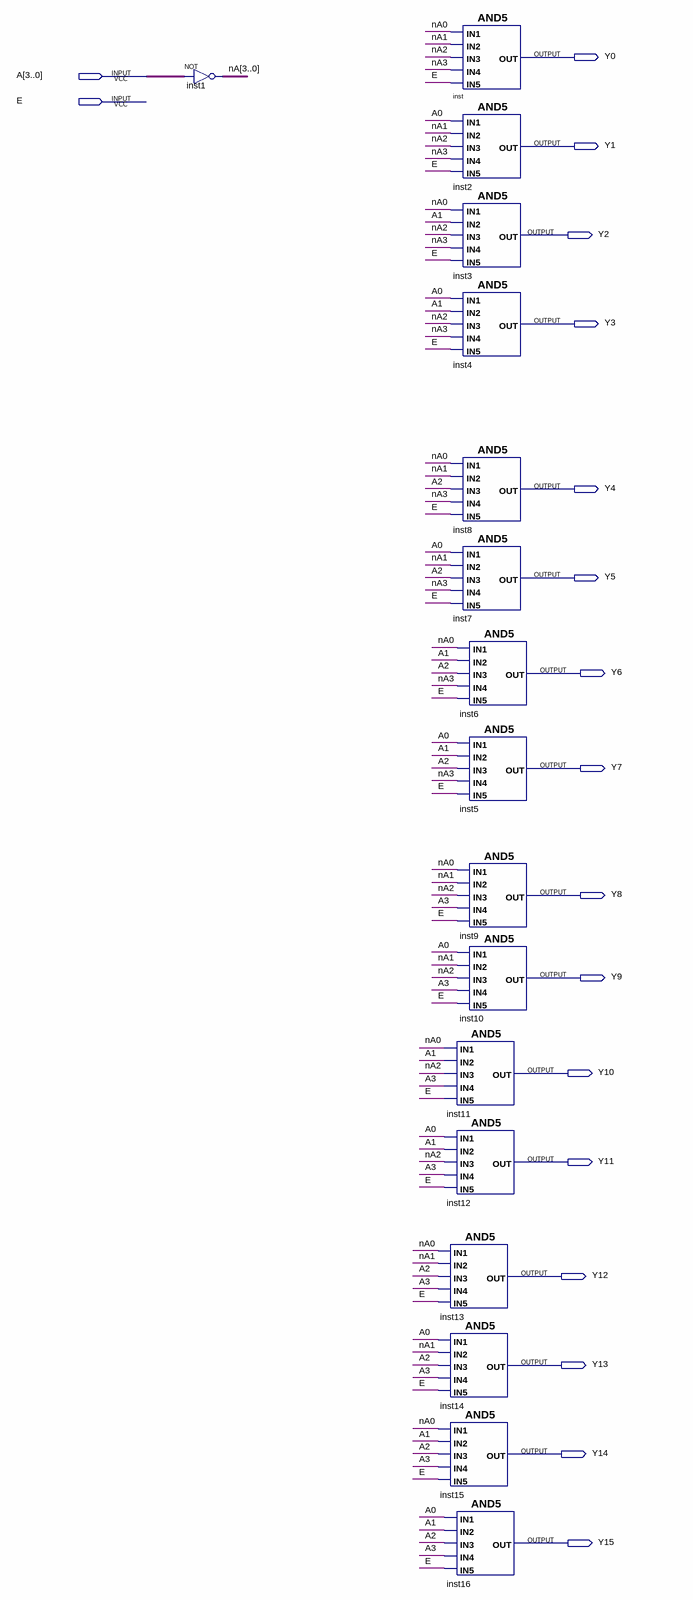
[diagram p0: schematic sheet]
// Quartus schematic DC16TO4.bdf as structural Verilog: 17 symbols, 18 pins
module DC16TO4 (
  input  [3:0] A,
  input  E,
  output Y0,
  output Y1,
  output Y2,
  output Y3,
  output Y4,
  output Y5,
  output Y6,
  output Y7,
  output Y8,
  output Y9,
  output Y10,
  output Y11,
  output Y12,
  output Y13,
  output Y14,
  output Y15
);

  wire [3:0] nA;

  assign nA = ~A;  // NOT inst1, 4 bits wide
  and inst (Y0, nA[0], nA[1], nA[2], nA[3], E);
  and inst2 (Y1, A[0], nA[1], nA[2], nA[3], E);
  and inst3 (Y2, nA[0], A[1], nA[2], nA[3], E);
  and inst4 (Y3, A[0], A[1], nA[2], nA[3], E);
  and inst8 (Y4, nA[0], nA[1], A[2], nA[3], E);
  and inst7 (Y5, A[0], nA[1], A[2], nA[3], E);
  and inst6 (Y6, nA[0], A[1], A[2], nA[3], E);
  and inst5 (Y7, A[0], A[1], A[2], nA[3], E);
  and inst9 (Y8, nA[0], nA[1], nA[2], A[3], E);
  and inst10 (Y9, A[0], nA[1], nA[2], A[3], E);
  and inst11 (Y10, nA[0], A[1], nA[2], A[3], E);
  and inst12 (Y11, A[0], A[1], nA[2], A[3], E);
  and inst13 (Y12, nA[0], nA[1], A[2], A[3], E);
  and inst14 (Y13, A[0], nA[1], A[2], A[3], E);
  and inst15 (Y14, nA[0], A[1], A[2], A[3], E);
  and inst16 (Y15, A[0], A[1], A[2], A[3], E);
endmodule
